# EAGLE schematic CAN-Raspi (EAGLE 7.4.0)
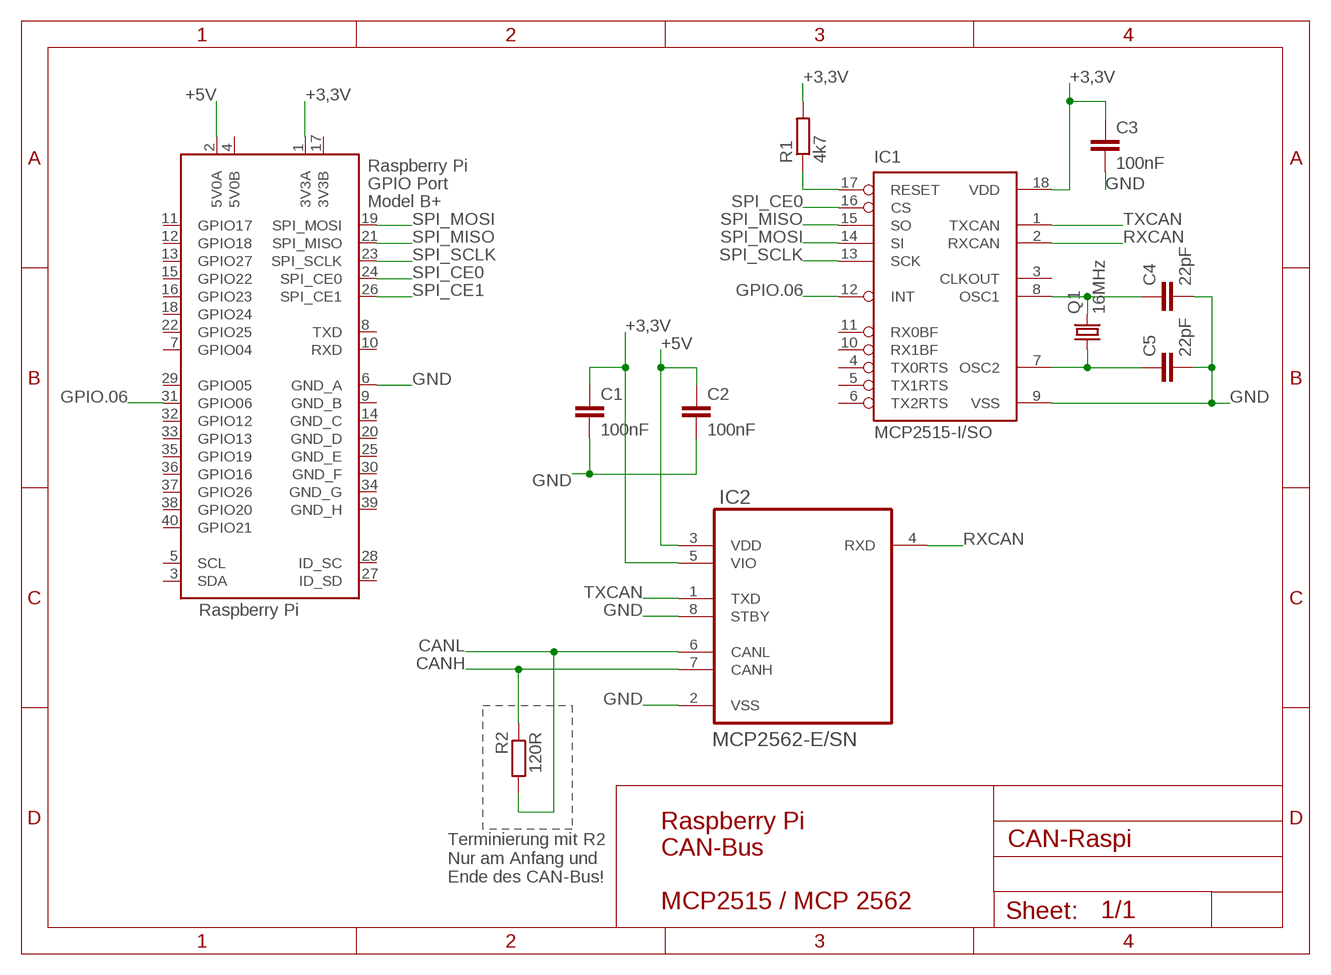
[diagram p0: schematic, sheet 1]

## Parts
C1  100nF  C-EUC1206  [C1206]
C2  100nF  C-EUC1206  [C1206]
C3  100nF  C-EUC1206  [C1206]
C4  22pF  C-EUC1206  [C1206]
C5  22pF  C-EUC1206  [C1206]
IC1  MCP2515-I/SO  [SO18L]
IC2  MCP2562-E/SN  [SO08]
Q1  16MHz  CRYSTALHC49UP  [HC49UP]
R1  4k7  R-EU_R1206  [R1206]
R2  120R  R-EU_R1206  [R1206]
X1  RASPI_GPIO_B+#_BOX  [RASPI_GPIO_B+_BOX]

## Nets
+3,3V: C1.1 C3.1 IC1.18(VDD) IC2.5(VIO) R1.2 X1.1(3V3A)
+5V: C2.1 IC2.3(VDD) X1.2(5V0A)
CANH: IC2.7(CANH) R2.1
CANL: IC2.6(CANL) R2.2
GND: C1.2 C2.2 C3.2 C4.2 C5.2 IC1.9(VSS) IC2.2(VSS) IC2.8(STBY) X1.6(GND_A)
GPIO.06: IC1.12(INT) X1.31(GPIO06)
N$1: C4.1 IC1.8(OSC1) Q1.2
N$2: IC1.17(RESET) R1.1
N$4: C5.1 IC1.7(OSC2) Q1.1
RXCAN: IC1.2(RXCAN) IC2.4(RXD)
SPI_CE0: IC1.16(CS) X1.24(SPI_CE0)
SPI_CE1: X1.26(SPI_CE1)
SPI_MISO: IC1.15(SO) X1.21(SPI_MISO)
SPI_MOSI: IC1.14(SI) X1.19(SPI_MOSI)
SPI_SCLK: IC1.13(SCK) X1.23(SPI_SCLK)
TXCAN: IC1.1(TXCAN) IC2.1(TXD)
Unconnected: IC1.3(CLKOUT) IC1.4(TX0RTS) IC1.5(TX1RTS) IC1.6(TX2RTS) IC1.10(RX1BF) IC1.11(RX0BF) X1.3(SDA) X1.5(SCL) X1.7(GPIO04) X1.8(TXD) X1.10(RXD) X1.11(GPIO17) X1.12(GPIO18) X1.13(GPIO27) X1.15(GPIO22) X1.16(GPIO23) X1.18(GPIO24) X1.22(GPIO25) X1.27(ID_SD) X1.28(ID_SC) X1.29(GPIO05) X1.32(GPIO12) X1.33(GPIO13) X1.35(GPIO19) X1.36(GPIO16) X1.37(GPIO26) X1.38(GPIO20) X1.40(GPIO21)

## Notes on the sheet
- Raspberry Pi
- Raspberry Pi
  CAN-Bus
  
  MCP2515 / MCP 2562
- Terminierung mit R2
  Nur am Anfang und
  Ende des CAN-Bus!

## Power pins joined to a net without a drawn wire
3V3B: X1.17(3V3B)
5V0B: X1.4(5V0B)
GND_B: X1.9(GND_B)
GND_C: X1.14(GND_C)
GND_D: X1.20(GND_D)
GND_E: X1.25(GND_E)
GND_F: X1.30(GND_F)
GND_G: X1.34(GND_G)
GND_H: X1.39(GND_H)

## Library data of the parts
C1-C5 = rcl:C-EU: CAPACITOR, European symbol
IC1 = mcp2515_2551_2562:MCP2515
IC2 = mcp2515_2551_2562:MCP2562: High-Speed CAN Transceiver,DIP-8
Q1 = crystal:CRYSTAL: CRYSTAL; OC_FARNELL: unknown; OC_NEWARK: unknown
R1 R2 = rcl:R-EU_: RESISTOR, European symbol
X1 = raspberrypi_bastelstube_v13:RASPI_GPIO_B+#: 2x20 header connector, all pins connected

## Net classes
1 24V: width 0.813 mm, clearance 0.406 mm